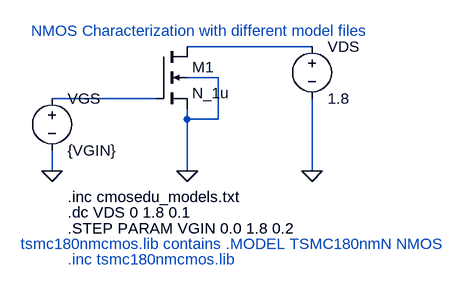
[diagram p0: schematic NMOS_Char1.asc]
NMOS_Char1.asc, the LTspice schematic file:
Version 4.1
SHEET 1 880 680
WIRE 368 144 176 144
WIRE 224 192 176 192
WIRE 128 224 -32 224
WIRE 176 256 176 240
WIRE 224 256 224 192
WIRE 224 256 176 256
WIRE -32 336 -32 304
WIRE 176 336 176 256
WIRE 368 336 368 224
FLAG -32 336 0
FLAG 368 336 0
FLAG 176 336 0
SYMBOL nmos4 128 144 R0
SYMATTR InstName M1
SYMATTR Value N_1u
SYMATTR Value2 l=2u w=10u
SYMBOL voltage 368 128 R0
WINDOW 123 0 0 Left 0
WINDOW 39 0 0 Left 0
SYMATTR InstName VDS
SYMATTR Value 1.8
SYMBOL voltage -32 208 R0
WINDOW 123 0 0 Left 0
WINDOW 39 0 0 Left 0
SYMATTR InstName VGS
SYMATTR Value {VGIN}
TEXT -8 376 Left 2 !.inc cmosedu_models.txt
TEXT -8 400 Left 2 !.dc VDS 0 1.8 0.1
TEXT -64 120 Left 2 ;NMOS Characterization with different model files
TEXT -8 424 Left 2 !.STEP PARAM VGIN 0.0 1.8 0.2
TEXT -80 448 Left 2 ;tsmc180nmcmos.lib contains .MODEL TSMC180nmN NMOS
TEXT -8 472 Left 2 ;.inc tsmc180nmcmos.lib

The netlist it stands for:
* NMOS_Char1.asc
M1 N001 N002 0 0 N_1u l=2u w=10u
VDS N001 0 1.8
VGS N002 0 {VGIN}
.model NMOS NMOS
.model PMOS PMOS
.lib standard.mos
.inc cmosedu_models.txt
.dc VDS 0 1.8 0.1
* NMOS Characterization with different model files
.STEP PARAM VGIN 0.0 1.8 0.2
* tsmc180nmcmos.lib contains .MODEL TSMC180nmN NMOS
* .inc tsmc180nmcmos.lib
.backanno
.end